# Altium schematic sheet Power.SchDoc
size A4; SheetNumber: 4; SheetTotal: 5
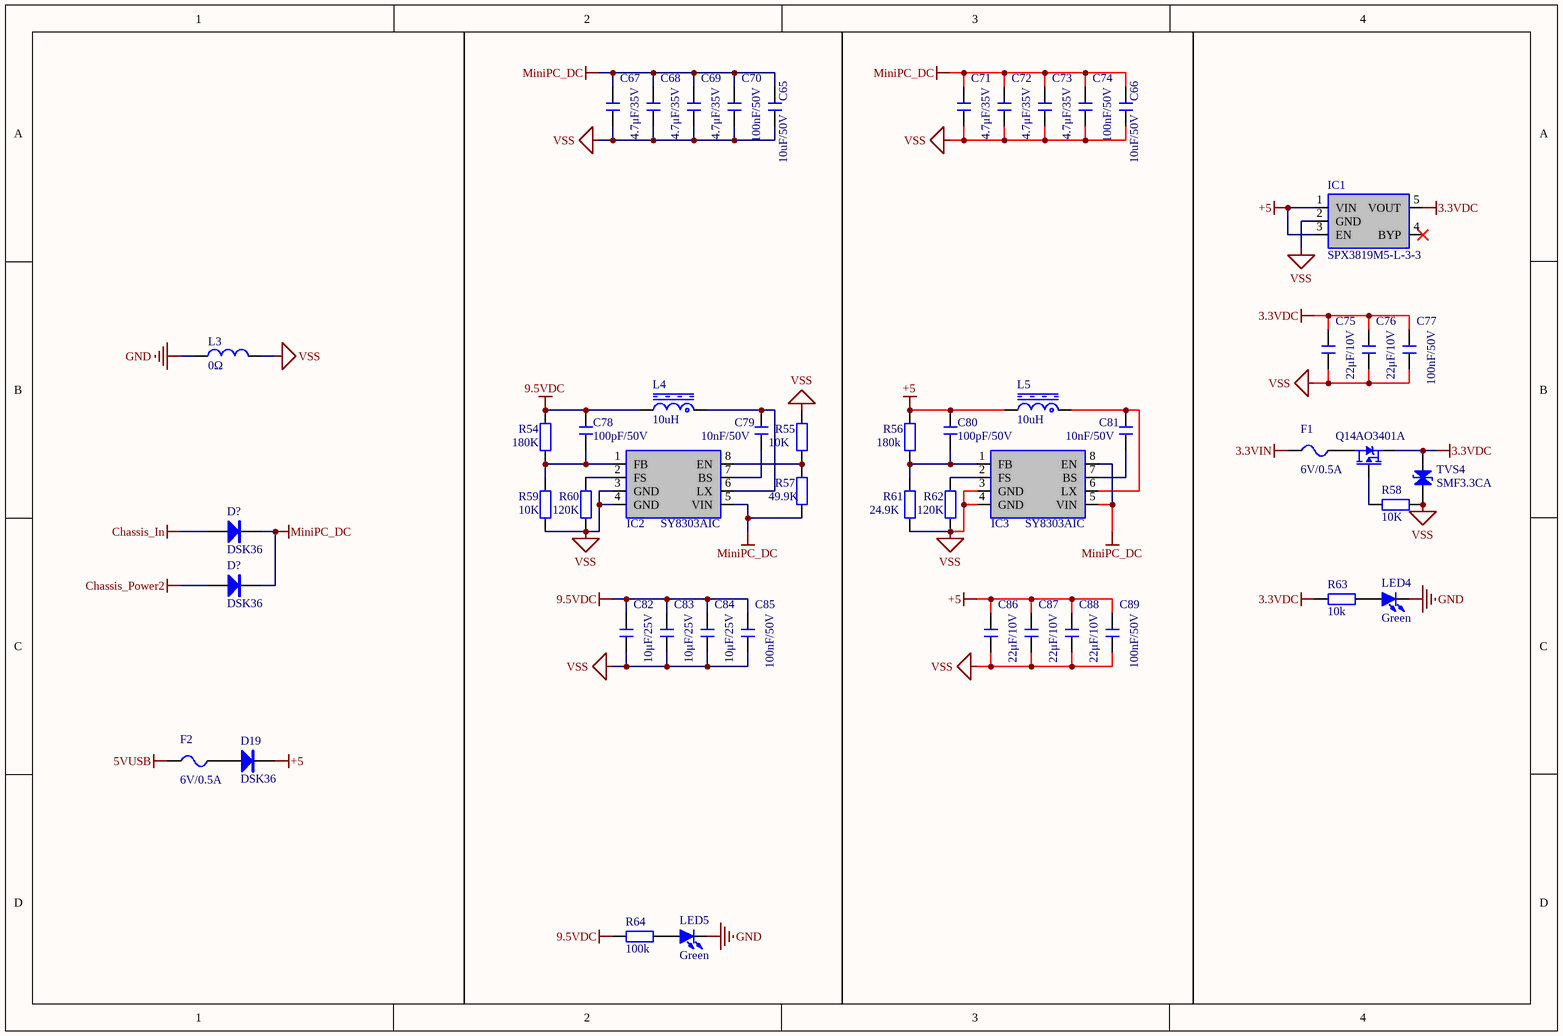
[diagram p0: Power.SchDoc]

## Parts
(Parts that share a designator on the sheet are numbered #1, #2 ... from top to bottom, then left to right.)
C65  10uF/50V  [C 1206_L]
C66  10uF/50V  [C 0805_M]
C67  4.7μF/35V  [C 0603_L]
C68  4.7μF/35V  [C 0603_L]
C69  4.7μF/35V  [C 0603_L]
C70  100nF/50V  [C 0603_L]
C71  4.7μF/35V  [C 0603_L]
C72  4.7μF/35V  [C 0603_L]
C73  4.7μF/35V  [C 0603_L]
C74  100nF/50V  [C 0603_L]
C75  22μF/10V  [C 0603_L]
C76  22μF/10V  [C 0603_L]
C77  100nF/50V  [C 0603_L]
C78  100pF/50V  [C 0603_L]
C79  10nF/50V  [C 0603_L]
C80  100pF/50V  [C 0603_L]
C81  10nF/50V  [C 0603_L]
C82  10μF/25V  [C 0603_L]
C83  10μF/25V  [C 0603_L]
C84  10μF/25V  [C 0603_L]
C85  100nF/50V  [C 0603_L]
C86  22μF/10V  [C 0603_L]
C87  22μF/10V  [C 0603_L]
C88  22μF/10V  [C 0603_L]
C89  100nF/50V  [C 0603_L]
D19  DSK36  [SOD-123F]
D?#1  DSK36  [SOD-123F]
D?#2  DSK36  [SOD-123F]
F1  6V/0.5A  [FU 0603]
F2  6V/0.5A  [FU 0603]
IC1  SPX3819M5-L-3-3  [SOT23-5L]
IC2  SY8303AIC  [SOT23-8L]
IC3  SY8303AIC  [SOT23-8L]
L3  0Ω  [L 0603]
L4  10uH  [CKST0502]
L5  10uH  [CKST0502]
LED4  Green  [LED 0603Y]
LED5  Green  [LED 0603Y]
Q14  AO3401A  [SOT23-3L]
R54  180K  [R 0603-HP_L]
R55  10K  [R 0603_L]
R56  180k  [R 0603-HP_L]
R57  49.9K  [R 0603_L]
R58  10K  [R 0603_L]
R59  10K  [R 0603-HP_L]
R60  120K  [R 0603_L]
R61  24.9K  [R 0603-HP_L]
R62  120K  [R 0603_L]
R63  10k  [R 0603_L]
R64  100k  [R 0603_L]
TVS4  SMF3.3CA  [SOD-123F]

## Nets
3.3VDC: C75.1 C76.1 C77.2 IC1.5(VOUT) Q14.3(S) R63.1 TVS4.1(A)
3.3VIN: F1.1
5VUSB: F2.1
9.5VDC: C78.2 C82.1 C83.1 C84.1 C85.2 L4.2 R54.1 R64.1
+5: C80.2 C86.1 C87.1 C88.1 C89.2 D19.2(K) IC1.1(VIN) IC1.3(EN) L5.2 R56.1
Chassis_In: D?#1.1(A)
Chassis_Power2: D?#2.1(A)
GND: L3.1 LED4.2(K) LED5.2(K)
MiniPC_DC: C65.1 C66.1 C67.1 C68.1 C69.1 C70.2 C71.1 C72.1 C73.1 C74.2 D?#1.2(K) D?#2.2(K) IC2.5(VIN) IC3.5(VIN) IC3.8(EN) R57.1
VSS: C65.2 C66.2 C67.2 C68.2 C69.2 C70.1 C71.2 C72.2 C73.2 C74.1 C75.2 C76.2 C77.1 C82.2 C83.2 C84.2 C85.1 C86.2 C87.2 C88.2 C89.1 IC1.2(GND) IC2.3(GND) IC2.4(GND) IC3.3(GND) IC3.4(GND) L3.2 R55.2 R58.2 R59.1 R60.1 R61.1 R62.1 TVS4.2(K)
NetC78_1: C78.1 IC2.1(FB) R54.2 R59.2
NetC79_1: C79.1 IC2.6(LX) L4.1
NetC79_2: C79.2 IC2.7(BS)
NetC80_1: C80.1 IC3.1(FB) R56.2 R61.2
NetC81_1: C81.1 IC3.6(LX) L5.1
NetC81_2: C81.2 IC3.7(BS)
NetD19_1: D19.1(A) F2.2
NetF1_2: F1.2 Q14.2(D)
NetIC2_2: IC2.2(FS) R60.2
NetIC2_8: IC2.8(EN) R55.1 R57.2
NetIC3_2: IC3.2(FS) R62.2
NetLED4_1: LED4.1(A) R63.2
NetLED5_1: LED5.1(A) R64.2
NetQ14_1: Q14.1(G) R58.1

Not connected (* = marked no-connect by the designer): IC1 4(BYP)*

## Library data of the parts
C65-C89 = C: 无极性贴片电容; 版权归属: 源创客; BOM名称: 无极性贴片电容; 学习资源: www.ooocke.com
D19 D?#1 D?#2 = SS34: 肖特基二极管; 版权归属: 源创客; 属性: 40V/3A; BOM名称: 肖特基二极管; 学习资源: www.ooocke.com
F1 F2 = FU: 贴片保险丝; 版权归属: 源创客; BOM名称: 贴片保险丝; 学习资源: www.ooocke.com
IC1 = SPX3819: LDO线性稳压芯片
IC2 IC3 = SY8303: DC降压芯片; 版权归属: 源创客; 学习资源: www.ooocke.com
L3 = L: 小功率贴片电感; 版权归属: 源创客; BOM名称: 小功率贴片电感; 学习资源: www.ooocke.com
L4 L5 = L-HP: 一体成型电感; BOM名称: 功率屏蔽电感; 版权归属: 源创客; 学习资源: www.ooocke.com
LED4 LED5 = LED-SMD: 贴片LED; 版权归属: 源创客; BOM名称: 贴片LED; 学习资源: www.ooocke.com
Q14 = PMOS_SS: 贴片信号P沟道场效应管; pin to pad: 2>3 3>2; 版权归属: 源创客; BOM名称: P沟道场效应管; 学习资源: www.ooocke.com
R54 R56 R59 R61 = R-Precision: 精密贴片电阻; BOM名称: 精密电阻; 版权归属: 源创客; 学习资源: www.ooocke.com
R55 R57 R58 R60 R62-R64 = R: 贴片电阻; 版权归属: 源创客; BOM名称: 贴片电阻; 学习资源: www.ooocke.com
TVS4 = TVS: 瞬态电压抑制二极管; 版权归属: 源创客; BOM名称: 瞬态电压抑制二极管; 学习资源: www.ooocke.com